# EAGLE schematic deviceoutlet (EAGLE 5.00)
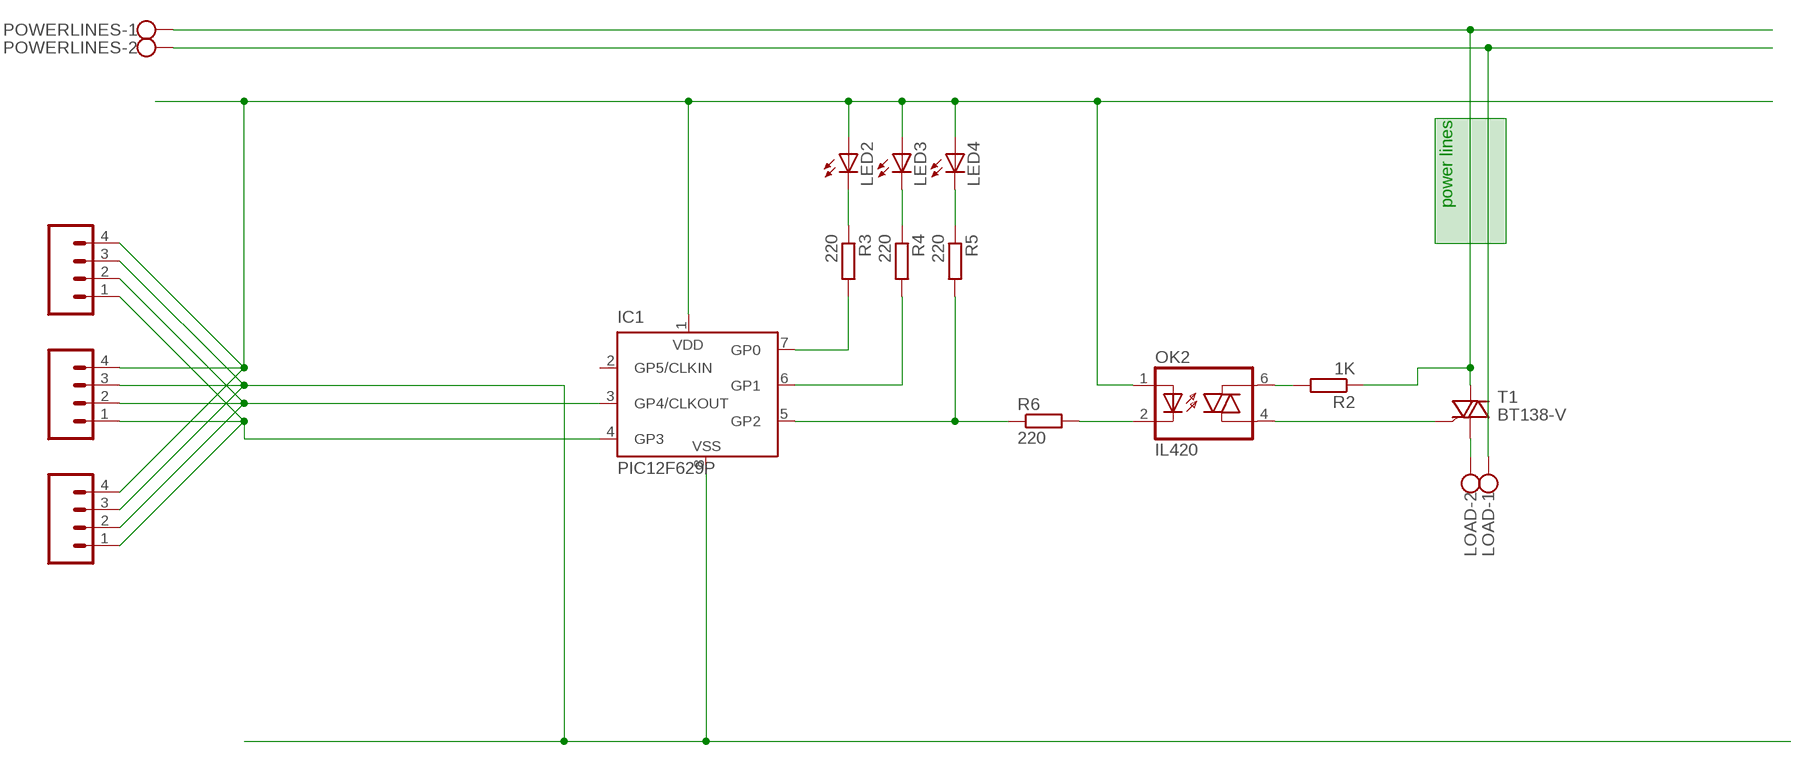
[diagram p0: schematic, sheet 1]

## Parts
IC1  PIC12F629P  [DIL8]
LED2  LED3MM  [LED3MM]
LED3  LED3MM  [LED3MM]
LED4  LED3MM  [LED3MM]
LOAD  W237-102  [W237-102]
OK2  IL420  [DIL06]
POWERLINES  W237-102  [W237-102]
R2  1K  R-EU_0204/7  [0204/7]
R3  220  R-EU_0204/7  [0204/7]
R4  220  R-EU_0204/7  [0204/7]
R5  220  R-EU_0204/7  [0204/7]
R6  220  R-EU_0204/7  [0204/7]
T1  BT138-V  [TO220BV]
U$2  RJ9PTH  [RJ9]
U$4  RJ9PTH  [RJ9]
U$5  RJ9PTH  [RJ9]

## Nets
N$1: IC1.3(GP4/CLKOUT) U$2.2 U$4.2 U$5.2
N$2: IC1.5(GP2) R5.2 R6.1
N$3: LOAD.1 POWERLINES.2
N$4: LOAD.2 T1.T1(A1)
N$5: IC1.7(GP0) R3.2
N$7: IC1.8(VSS) U$2.3 U$4.3 U$5.3
N$8: IC1.1(VDD) LED2.A LED3.A LED4.A OK2.1(A) U$2.4 U$4.4 U$5.4
N$9: IC1.4(GP3) U$2.1 U$4.1 U$5.1
N$11: OK2.4(A1) T1.G
N$12: OK2.6(A2) R2.2
N$14: IC1.6(GP1) R4.2
N$15: LED2.K(C) R3.1
N$16: LED3.K(C) R4.1
N$17: LED4.K(C) R5.1
N$18: POWERLINES.1 R2.1 T1.T2(A2)
N$19: OK2.2(C) R6.2
Unconnected: IC1.2(GP5/CLKIN)

## Notes on the sheet
- power lines

## Library data of the parts
IC1 = microchip:PIC12F6*: Data Sheet 8-Pin FLASH-Based 8-Bit CMOS Microcontrollers Source: http://www.microchip.com .. 41190c.pdf
LED2-LED4 = led:LED: LED OSRAM: - CHIPLED LG R971, LG N971, LY N971, LG Q971, LY Q971, LO R971, LY R971 LH N974, LH R974 LS Q976, LO Q976, LY Q976 LO Q996 - Hyper CHIPLED LW Q18S LB Q993, LB Q99A, LB R99A - SideLED LS A670, LO A670, LY A670, LG A670, LP A670 LB A673, LV A673, LT A673, LW A673 LH A674 LY A675 LS A676, LA A676, LO A676, LY A676, LW A676 LS A679, LY A679, LG A679 - Hyper Micro SIDELED® LS Y876, LA Y876, LO Y876, LY Y876 LT Y87S - SmartLED LW L88C, LW L88S LB L89C, LB L89S, LG L890 LS L89K, LO L89K, LY L89K LS L896, LA L896, LO L896, LY L896 - TOPLED LS T670, LO T670, LY T670, LG T670, LP T670 LSG T670, LSP T670, LSY T670, LOP T670, LYG T670 LG T671, LOG T671, LSG T671 LB T673, LV T673, LT T673, LW T673 LH T674 LS T676, LA T676, LO T676, LY T676, LB T676, LH T676, LSB T676, LW T676 LB T67C, LV T67C, LT T67C, LS T67K, LO T67K, LY T67K, LW E67C LS E67B, LA E67B, LO E67B, LY E67B, LB E67C, LV E67C, LT E67C LW T67C LS T679, LY T679, LG T679 LS T770, LO T770, LY T770, LG T770, LP T770 LB T773, LV T773, LT T773, LW T773 LH T774 LS E675, LA E675, LY E675, LS T675 LS T776, LA T776, LO T776, LY T776, LB T776 LHGB T686 LT T68C, LB T68C - Hyper Mini TOPLED® LB M676 - Mini TOPLED Santana® LG M470 LS M47K, LO M47K, LY M47K Source: http://www.osram.convergy.de LUXEON: - LUMILED® LXK2-PW12-R00, LXK2-PW12-S00, LXK2-PW14-U00, LXK2-PW14-V00 LXK2-PM12-R00, LXK2-PM12-S00, LXK2-PM14-U00 LXK2-PE12-Q00, LXK2-PE12-R00, LXK2-PE12-S00, LXK2-PE14-T00, LXK2-PE14-U00 LXK2-PB12-K00, LXK2-PB12-L00, LXK2-PB12-M00, LXK2-PB14-N00, LXK2-PB14-P00, LXK2-PB14-Q00 LXK2-PR12-L00, LXK2-PR12-M00, LXK2-PR14-Q00, LXK2-PR14-R00 LXK2-PD12-Q00, LXK2-PD12-R00, LXK2-PD12-S00 LXK2-PH12-R00, LXK2-PH12-S00 LXK2-PL12-P00, LXK2-PL12-Q00, LXK2-PL12-R00 Source: www.luxeon.com KINGBRIGHT: KA-3528ASYC Source: www.kingbright.com
LOAD POWERLINES = con-wago-500:W237-102: WAGO SCREW CLAMP
OK2 = optocoupler:IL420: SIEMENS OPTO COUPLER
R2-R6 = resistor:R-EU_: RESISTOR, European symbol
T1 = triac:BT138: TRIAC Source: http://www.semiconductors.philips.com BT138_SERIES_2.pdf
U$2 U$4 U$5 = SparkFun:RJ9